# Altium schematic sheet PCI_HIT_carrier_vGECCO - Copy.SchDoc
size A2
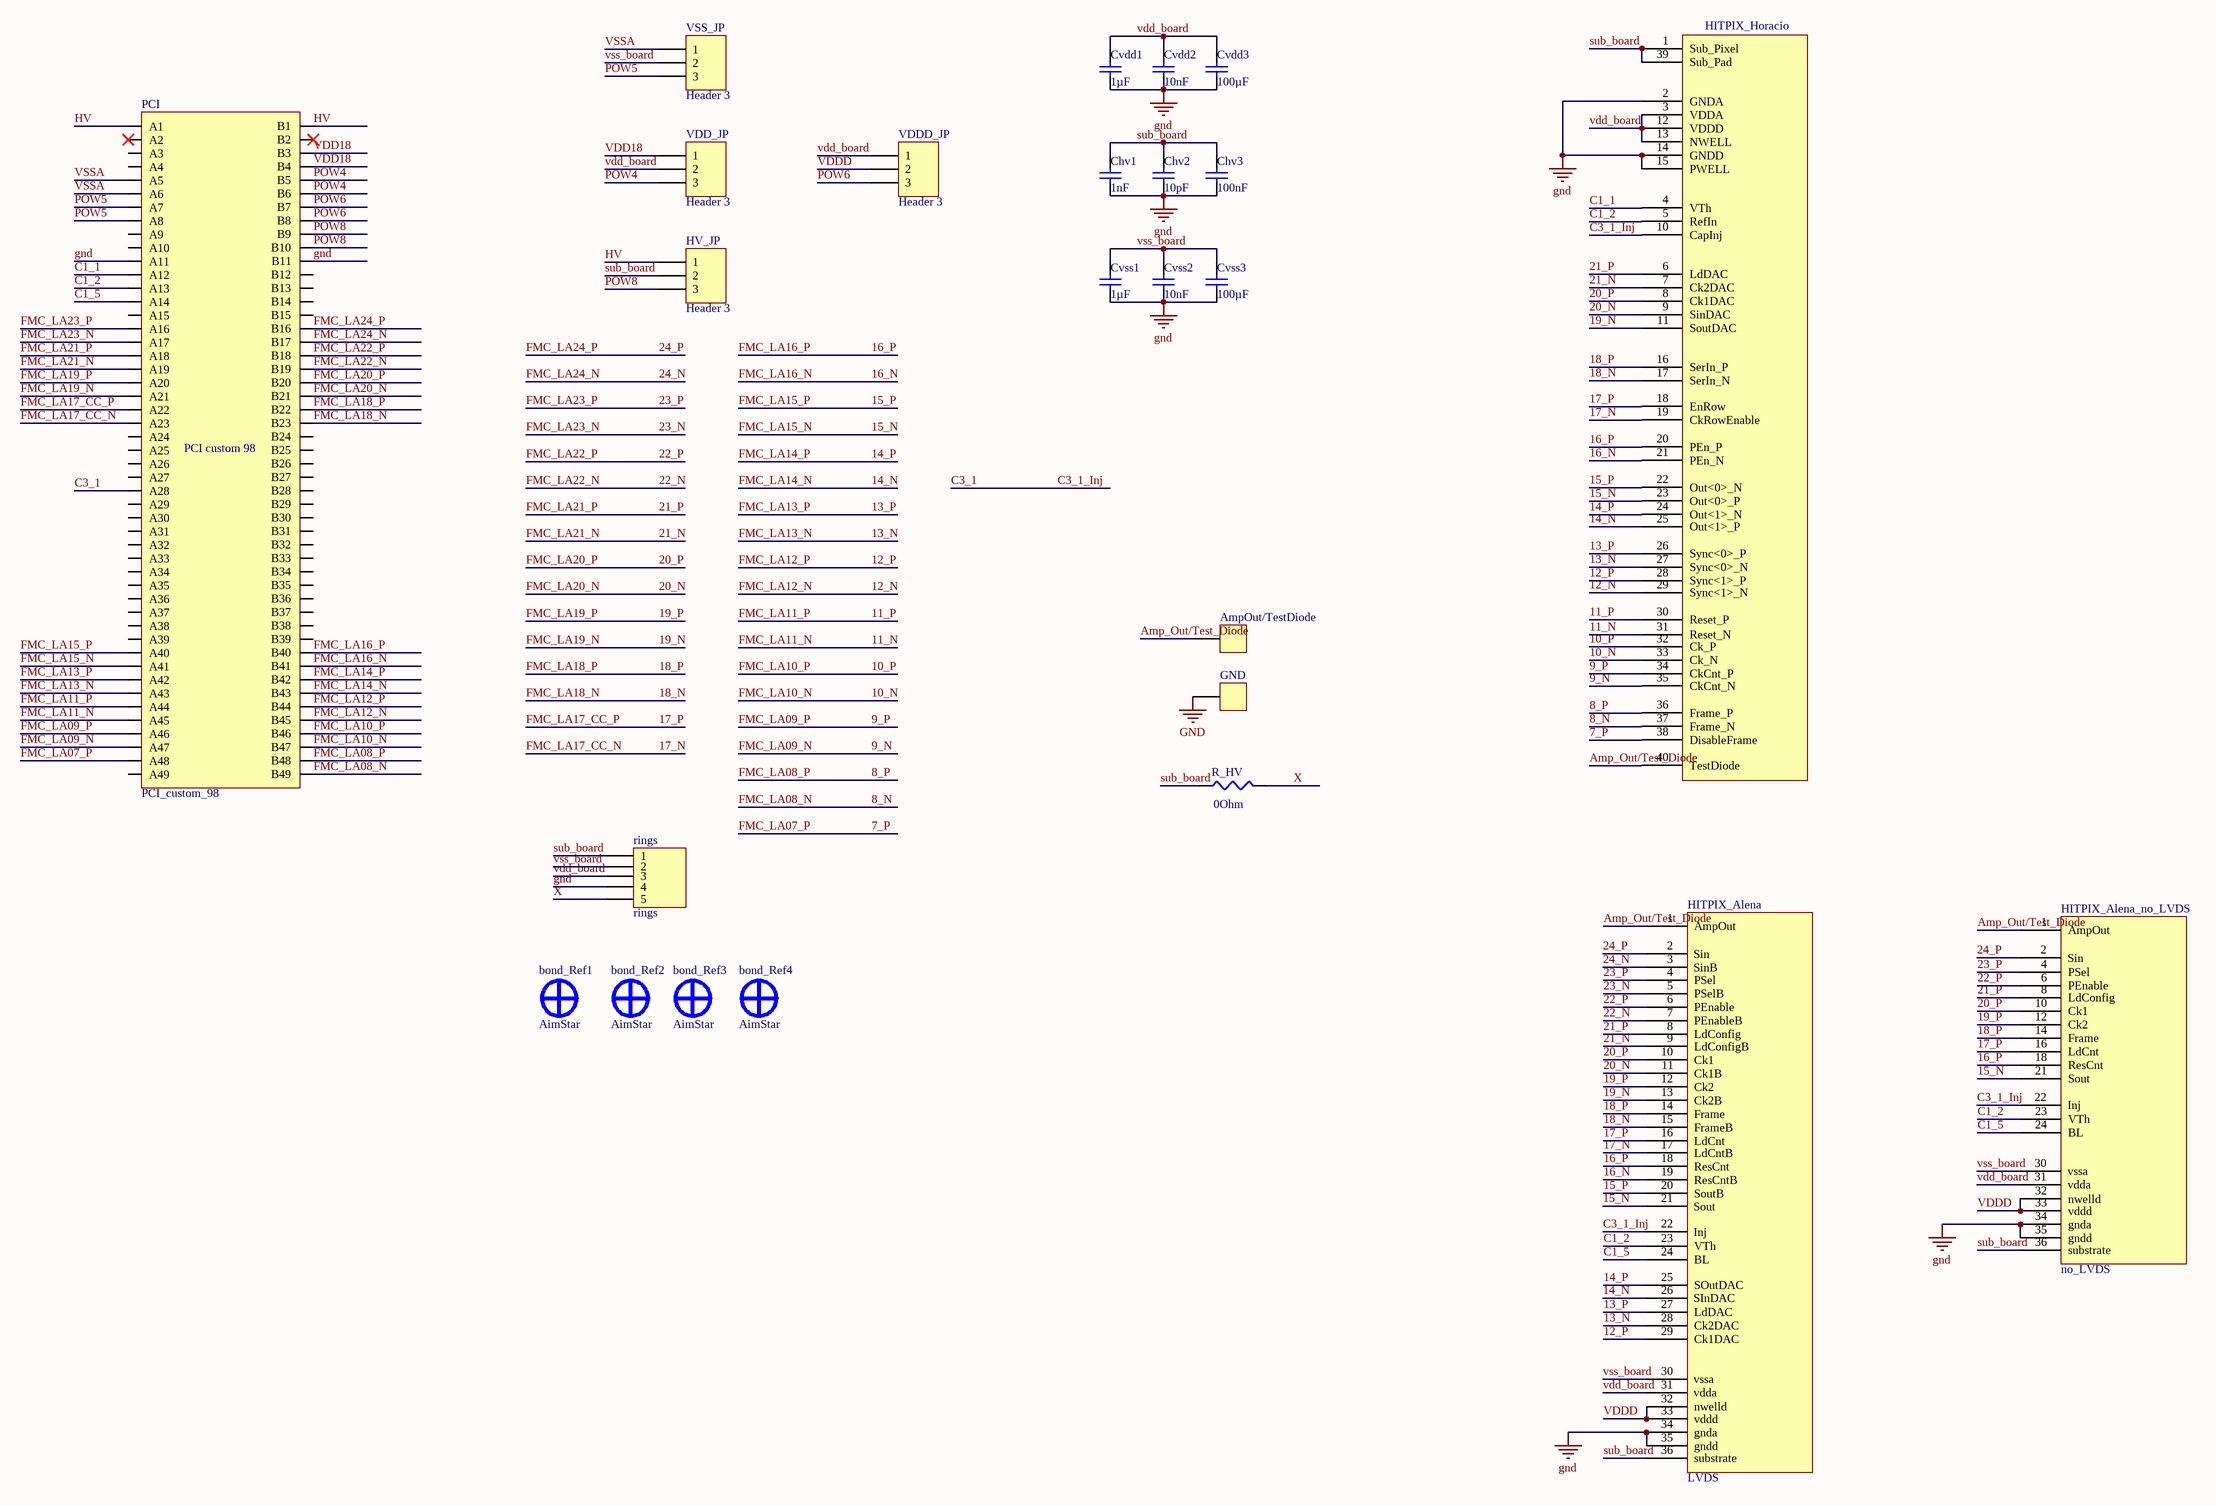
[diagram p0: PCI_HIT_carrier_vGECCO - Copy.SchDoc]

## Parts
AmpOut/TestDiode  Header 1  [HDR1]  (value not drawn)
bond_Ref1  AimStar  [AimStar_PCB]
bond_Ref2  AimStar  [AimStar_PCB]
bond_Ref3  AimStar  [AimStar_PCB]
bond_Ref4  AimStar  [AimStar_PCB]
Chv1  value 1nF  [1608[0603]]  (hidden comment: Cap Semi)
Chv2  value 10pF  [1608[0603]]  (hidden comment: Cap Semi)
Chv3  value 100nF  [C1210]  (hidden comment: Cap Semi)
Cvdd1  value 1µF  [1608[0603]]  (hidden comment: Cap Semi)
Cvdd2  value 10nF  [1608[0603]]  (hidden comment: Cap Semi)
Cvdd3  value 100µF  [C1210]  (hidden comment: Cap Semi)
Cvss1  value 1µF  [1608[0603]]  (hidden comment: Cap Semi)
Cvss2  value 10nF  [1608[0603]]  (hidden comment: Cap Semi)
Cvss3  value 100µF  [C1210]  (hidden comment: Cap Semi)
GND  Header 1  [HDR1]  (value not drawn)
HITPIX_Alena  LVDS  [PCBComponent_1]
HITPIX_Alena_no_LVDS  no_LVDS  [alena]
HITPIX_Horacio  Component_1  [PCBComponent_1]  (value not drawn)
HV_JP  Header 3  [HDR1X3]
PCI  PCI_custom_98  [PCI_98_Board]
R_HV  value 0Ohm  [14-1210]  (hidden comment: Res3)
rings  rings
VDD_JP  Header 3  [HDR1X3]
VDDD_JP  Header 3  [HDR1X3]
VSS_JP  Header 3  [HDR1X3]

## Nets
gnd: Chv1.1 Chv2.1 Chv3.1 Cvdd1.1 Cvdd2.1 Cvdd3.1 Cvss1.1 Cvss2.1 Cvss3.1 GND.1 HITPIX_Alena.34(gnda) HITPIX_Alena.35(gndd) HITPIX_Alena_no_LVDS.34(gnda) HITPIX_Alena_no_LVDS.35(gndd) HITPIX_Horacio.2(GNDA) HITPIX_Horacio.14(GNDD) HITPIX_Horacio.15(PWELL) PCI.A11 PCI.B11 rings.4
7_P: HITPIX_Horacio.38(DisableFrame) PCI.A48  [also labelled FMC_LA07_P]
8_N: HITPIX_Horacio.37(Frame_N) PCI.B49  [also labelled FMC_LA08_N]
8_P: HITPIX_Horacio.36(Frame_P) PCI.B48  [also labelled FMC_LA08_P]
9_N: HITPIX_Horacio.35(CkCnt_N) PCI.A47  [also labelled FMC_LA09_N]
9_P: HITPIX_Horacio.34(CkCnt_P) PCI.A46  [also labelled FMC_LA09_P]
10_N: HITPIX_Horacio.33(Ck_N) PCI.B47  [also labelled FMC_LA10_N]
10_P: HITPIX_Horacio.32(Ck_P) PCI.B46  [also labelled FMC_LA10_P]
11_N: HITPIX_Horacio.31(Reset_N) PCI.A45  [also labelled FMC_LA11_N]
11_P: HITPIX_Horacio.30(Reset_P) PCI.A44  [also labelled FMC_LA11_P]
12_N: HITPIX_Horacio.29(Sync<1>_N) PCI.B45  [also labelled FMC_LA12_N]
12_P: HITPIX_Alena.29(Ck1DAC) HITPIX_Horacio.28(Sync<1>_P) PCI.B44  [also labelled FMC_LA12_P]
13_N: HITPIX_Alena.28(Ck2DAC) HITPIX_Horacio.27(Sync<0>_N) PCI.A43  [also labelled FMC_LA13_N]
13_P: HITPIX_Alena.27(LdDAC) HITPIX_Horacio.26(Sync<0>_P) PCI.A42  [also labelled FMC_LA13_P]
14_N: HITPIX_Alena.26(SInDAC) HITPIX_Horacio.25(Out<1>_P) PCI.B43  [also labelled FMC_LA14_N]
14_P: HITPIX_Alena.25(SOutDAC) HITPIX_Horacio.24(Out<1>_N) PCI.B42  [also labelled FMC_LA14_P]
15_N: HITPIX_Alena.21(Sout) HITPIX_Alena_no_LVDS.21(Sout) HITPIX_Horacio.23(Out<0>_P) PCI.A41  [also labelled FMC_LA15_N]
15_P: HITPIX_Alena.20(SoutB) HITPIX_Horacio.22(Out<0>_N) PCI.A40  [also labelled FMC_LA15_P]
16_N: HITPIX_Alena.19(ResCntB) HITPIX_Horacio.21(PEn_N) PCI.B41  [also labelled FMC_LA16_N]
16_P: HITPIX_Alena.18(ResCnt) HITPIX_Alena_no_LVDS.18(ResCnt) HITPIX_Horacio.20(PEn_P) PCI.B40  [also labelled FMC_LA16_P]
17_N: HITPIX_Alena.17(LdCntB) HITPIX_Horacio.19(CkRowEnable) PCI.A23  [also labelled FMC_LA17_CC_N]
17_P: HITPIX_Alena.16(LdCnt) HITPIX_Alena_no_LVDS.16(LdCnt) HITPIX_Horacio.18(EnRow) PCI.A22  [also labelled FMC_LA17_CC_P]
18_N: HITPIX_Alena.15(FrameB) HITPIX_Horacio.17(SerIn_N) PCI.B23  [also labelled FMC_LA18_N]
18_P: HITPIX_Alena.14(Frame) HITPIX_Alena_no_LVDS.14(Frame) HITPIX_Horacio.16(SerIn_P) PCI.B22  [also labelled FMC_LA18_P]
19_N: HITPIX_Alena.13(Ck2B) HITPIX_Horacio.11(SoutDAC) PCI.A21  [also labelled FMC_LA19_N]
19_P: HITPIX_Alena.12(Ck2) HITPIX_Alena_no_LVDS.12(Ck2) PCI.A20  [also labelled FMC_LA19_P]
20_N: HITPIX_Alena.11(Ck1B) HITPIX_Horacio.9(SinDAC) PCI.B21  [also labelled FMC_LA20_N]
20_P: HITPIX_Alena.10(Ck1) HITPIX_Alena_no_LVDS.10(Ck1) HITPIX_Horacio.8(Ck1DAC) PCI.B20  [also labelled FMC_LA20_P]
21_N: HITPIX_Alena.9(LdConfigB) HITPIX_Horacio.7(Ck2DAC) PCI.A19  [also labelled FMC_LA21_N]
21_P: HITPIX_Alena.8(LdConfig) HITPIX_Alena_no_LVDS.8(LdConfig) HITPIX_Horacio.6(LdDAC) PCI.A18  [also labelled FMC_LA21_P]
22_N: HITPIX_Alena.7(PEnableB) PCI.B19  [also labelled FMC_LA22_N]
22_P: HITPIX_Alena.6(PEnable) HITPIX_Alena_no_LVDS.6(PEnable) PCI.B18  [also labelled FMC_LA22_P]
23_N: HITPIX_Alena.5(PSelB) PCI.A17  [also labelled FMC_LA23_N]
23_P: HITPIX_Alena.4(PSel) HITPIX_Alena_no_LVDS.4(PSel) PCI.A16  [also labelled FMC_LA23_P]
24_N: HITPIX_Alena.3(SinB) PCI.B17  [also labelled FMC_LA24_N]
24_P: HITPIX_Alena.2(Sin) HITPIX_Alena_no_LVDS.2(Sin) PCI.B16  [also labelled FMC_LA24_P]
Amp_Out/Test_Diode: AmpOut/TestDiode.1 HITPIX_Alena.1(AmpOut) HITPIX_Alena_no_LVDS.1(AmpOut) HITPIX_Horacio.40(TestDiode)
C1_1: HITPIX_Horacio.4(VTh) PCI.A12
C1_2: HITPIX_Alena.23(VTh) HITPIX_Alena_no_LVDS.23(VTh) HITPIX_Horacio.5(RefIn) PCI.A13
C1_5: HITPIX_Alena.24(BL) HITPIX_Alena_no_LVDS.24(BL) PCI.A14
C3_1: HITPIX_Alena.22(Inj) HITPIX_Alena_no_LVDS.22(Inj) HITPIX_Horacio.10(CapInj) PCI.A28  [also labelled C3_1_Inj]
HV: HV_JP.1 PCI.A1 PCI.B1
POW4: PCI.B5 PCI.B6 VDD_JP.3
POW5: PCI.A7 PCI.A8 VSS_JP.3
POW6: PCI.B7 PCI.B8 VDDD_JP.3
POW8: HV_JP.3 PCI.B9 PCI.B10
sub_board: Chv1.2 Chv2.2 Chv3.2 HITPIX_Alena.36(substrate) HITPIX_Alena_no_LVDS.36(substrate) HITPIX_Horacio.1(Sub_Pixel) HITPIX_Horacio.39(Sub_Pad) HV_JP.2 R_HV.1 rings.1
VDD18: PCI.B3 PCI.B4 VDD_JP.1
vdd_board: Cvdd1.2 Cvdd2.2 Cvdd3.2 HITPIX_Alena.31(vdda) HITPIX_Alena_no_LVDS.31(vdda) HITPIX_Horacio.3(VDDA) HITPIX_Horacio.12(VDDD) HITPIX_Horacio.13(NWELL) rings.3 VDD_JP.2 VDDD_JP.1
VDDD: HITPIX_Alena.32(nwelld) HITPIX_Alena.33(vddd) HITPIX_Alena_no_LVDS.32(nwelld) HITPIX_Alena_no_LVDS.33(vddd) VDDD_JP.2
vss_board: Cvss1.2 Cvss2.2 Cvss3.2 HITPIX_Alena.30(vssa) HITPIX_Alena_no_LVDS.30(vssa) rings.2 VSS_JP.2
VSSA: PCI.A5 PCI.A6 VSS_JP.1
X: R_HV.2 rings.5

Not connected (* = marked no-connect by the designer): PCI A2* A3 A4 A9 A10 A15 A24 A25 A26 A27 A29 A30 A31 A32 A33 A34 A35 A36 A37 A38 A39 A49 B2* B12 B13 B14 B15 B24 B25 B26 B27 B28 B29 B30 B31 B32 B33 B34 B35 B36 B37 B38 B39

## Notes on the sheet
- (in symbol PCI_custom_98) PCI custom 98

## Library data of the parts
AmpOut/TestDiode GND = Header 1: Header, 1-Pin; Revision: 17-Jul-2002: Re-released for DXP Platform.; Publisher: Altium Limited; Cost: 0,01
Chv1-Chv3 Cvdd1-Cvdd3 Cvss1-Cvss3 = Cap Semi: Capacitor (Semiconductor SIM Model); Published: 8-Jun-2000; LatestRevisionDate: 29-May-2009; LatestRevisionNote: IPC-7351 Footprint Added.; PackageReference: C1206; Publisher: Altium Limited; PackageDescription: Chip Capacitor
HITPIX_Alena = Component_1
HV_JP VDD_JP VDDD_JP VSS_JP = Header 3: Header, 3-Pin; LatestRevisionDate: 17-Jul-2002; LatestRevisionNote: Re-released for DXP Platform.; Publisher: Altium Limited
R_HV = Res3: Resistor; Published: 8-Jun-2000; LatestRevisionDate: 29-May-2009; LatestRevisionNote: IPC-7351 Footprint Added.; PackageReference: J1-0603; Publisher: Altium Limited; PackageDescription: Chip Resistor